# EAGLE design Keg Cop - Eight Straight (EAGLE 9.5.2)
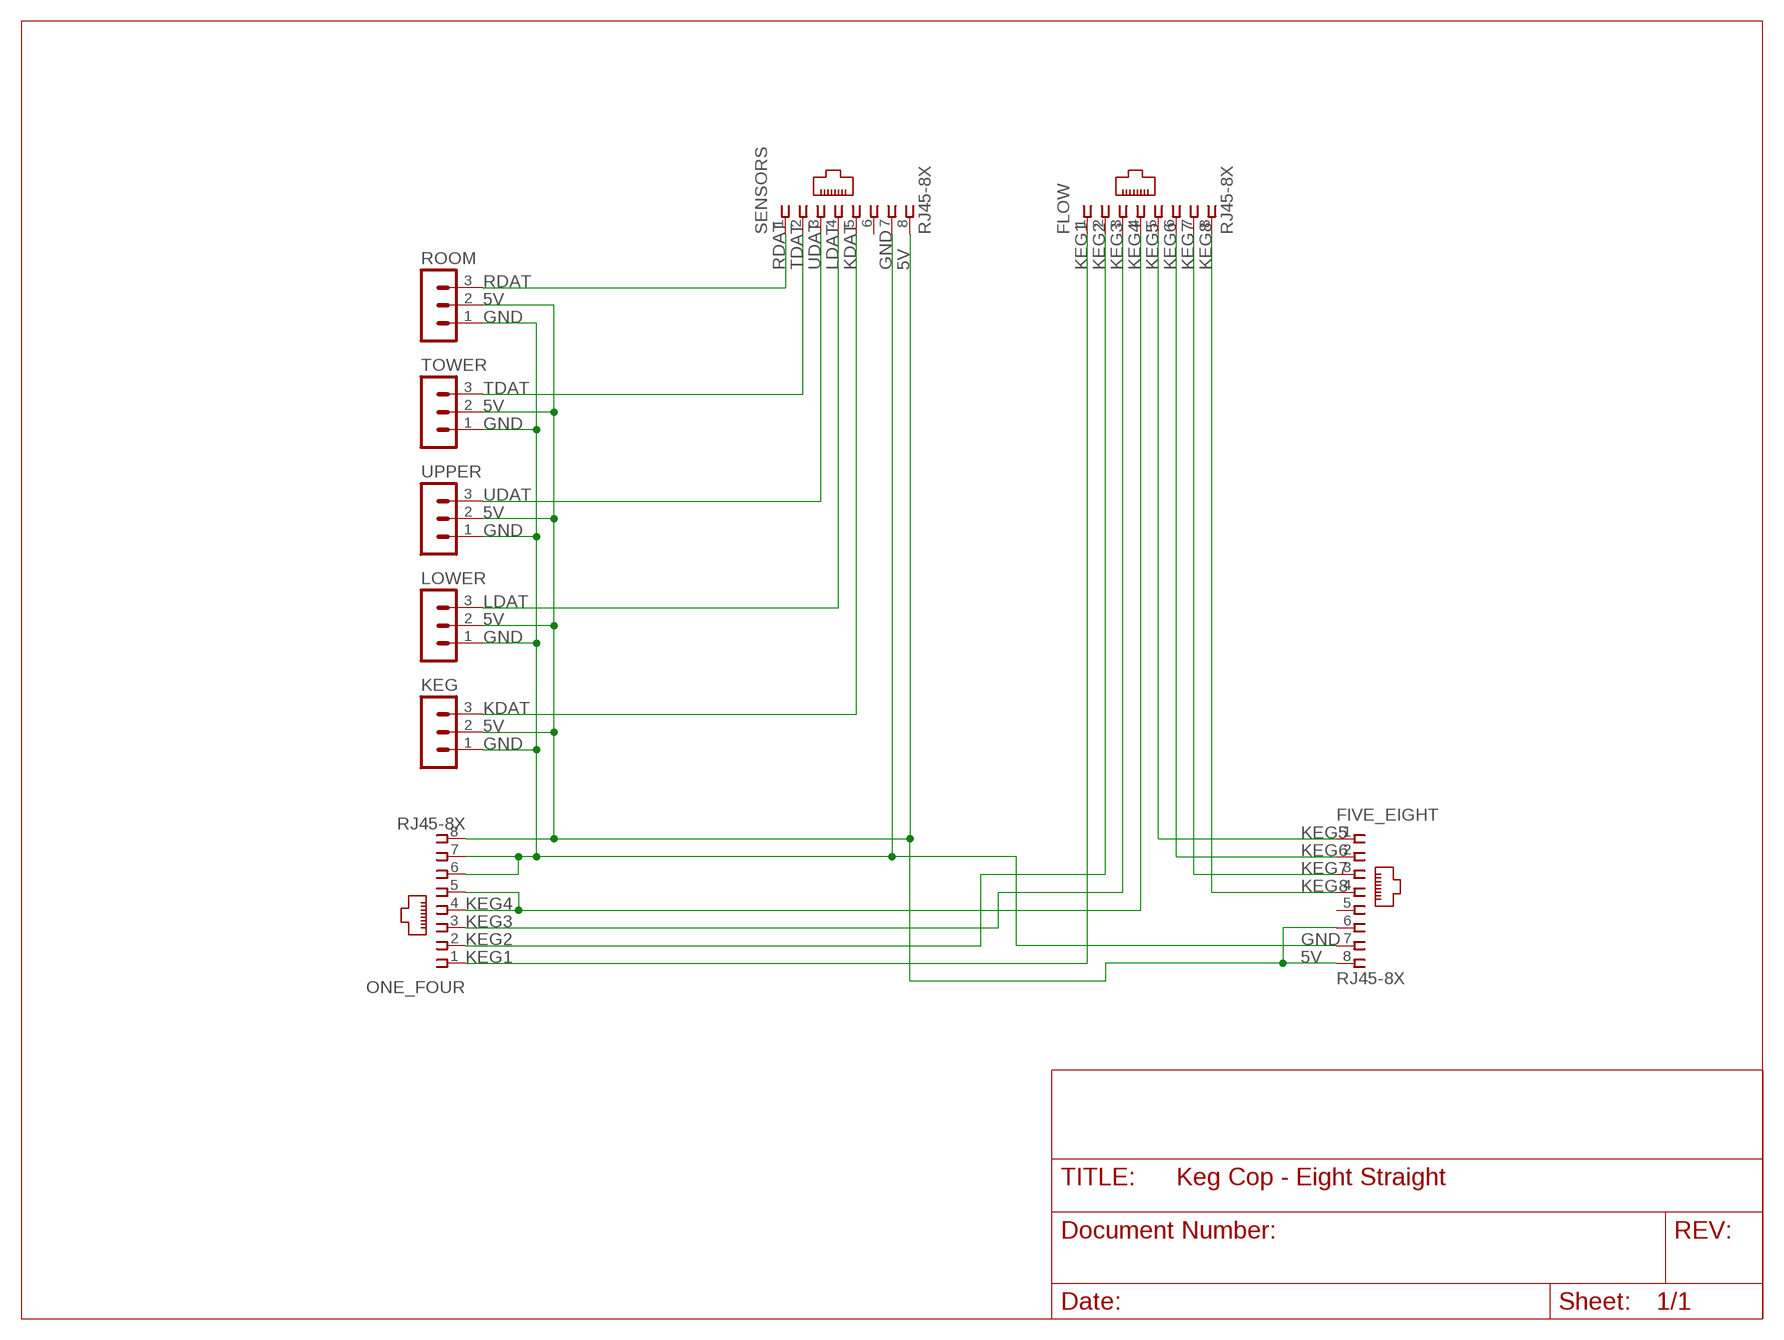
[diagram p0: schematic, sheet 1]

## Parts
FIVE_EIGHT  RJ45-8X  [RJ45-NO-SHIELD]
FLOW  RJ45-8X  [RJ45-NO-SHIELD]
KEG  HDR-3  [HDR-3_VERT]
LOWER  HDR-3  [HDR-3_VERT]
ONE_FOUR  RJ45-8X  [RJ45-NO-SHIELD]
ROOM  HDR-3  [HDR-3_VERT]
SENSORS  RJ45-8X  [RJ45-NO-SHIELD]
TOWER  HDR-3  [HDR-3_VERT]
UPPER  HDR-3  [HDR-3_VERT]

## Nets
5V: FIVE_EIGHT.6 FIVE_EIGHT.8 KEG.2 LOWER.2 ONE_FOUR.8 ROOM.2 SENSORS.8 TOWER.2 UPPER.2
GND: FIVE_EIGHT.7 KEG.1 LOWER.1 ONE_FOUR.6 ONE_FOUR.7 ROOM.1 SENSORS.7 TOWER.1 UPPER.1
KDAT: KEG.3 SENSORS.5
KEG1: FLOW.1 ONE_FOUR.1
KEG2: FLOW.2 ONE_FOUR.2
KEG3: FLOW.3 ONE_FOUR.3
KEG4: FLOW.4 ONE_FOUR.4 ONE_FOUR.5
KEG5: FIVE_EIGHT.1 FLOW.5
KEG6: FIVE_EIGHT.2 FLOW.6
KEG7: FIVE_EIGHT.3 FLOW.7
KEG8: FIVE_EIGHT.4 FLOW.8
LDAT: LOWER.3 SENSORS.4
RDAT: ROOM.3 SENSORS.1
TDAT: SENSORS.2 TOWER.3
UDAT: SENSORS.3 UPPER.3
Unconnected: FIVE_EIGHT.5 SENSORS.6

## Library data of the parts
FIVE_EIGHT FLOW ONE_FOUR SENSORS = con-tycoelectronics:RJ45: CORCOM Modular RJ Jacks No Shield Source: www.tycoelectronics.com .. ENG_DS_1654001_1099_RJ_L_0507.pdf; MPN: RJ45-8X; OC_FARNELL: unknown; OC_NEWARK: 16R6101
KEG LOWER ROOM TOWER UPPER = Donnie:HDR-3: PIN HEADER

## Board
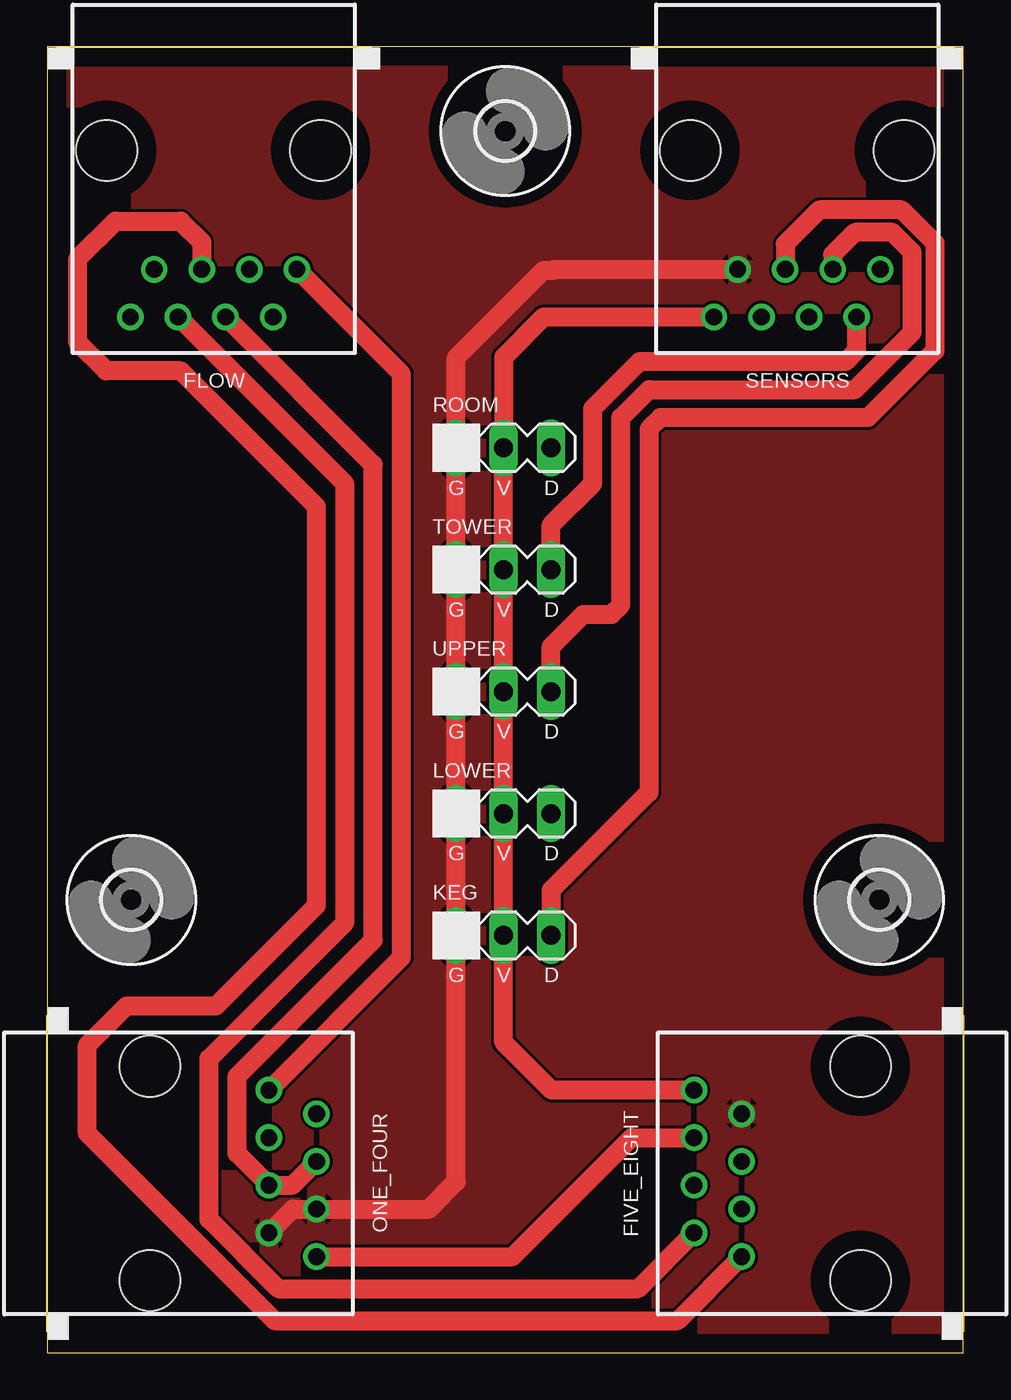
[diagram p1: board, top side]
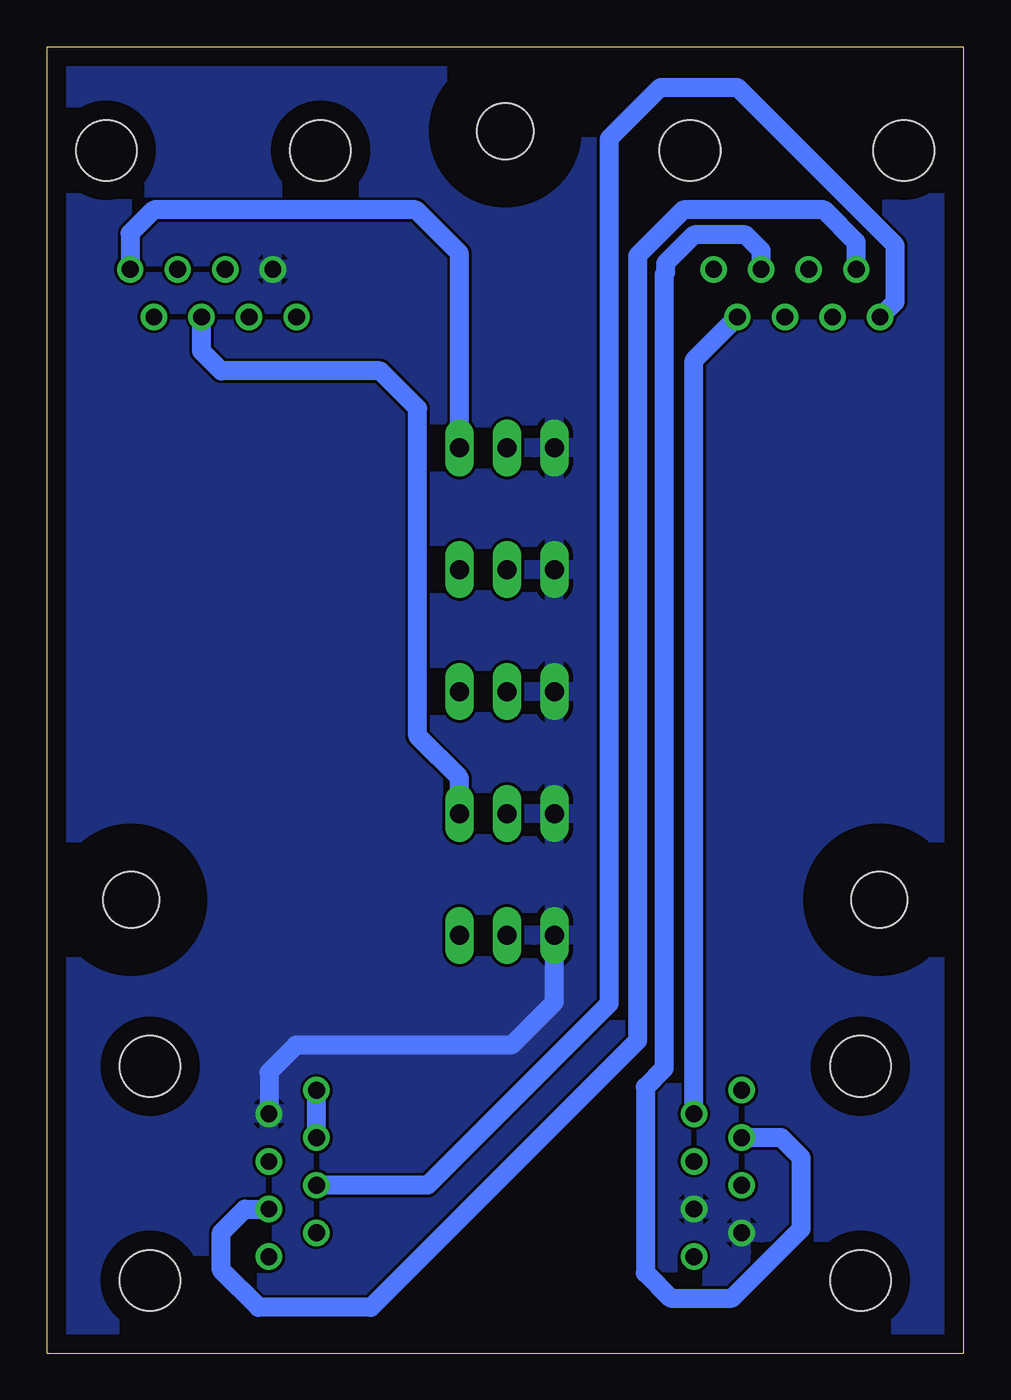
[diagram p2: board, bottom side, seen from below]

Size 48.97 x 69.74 mm. Coordinates in mm from the lower left corner, seen from the top.
Outline: 0.01,69.74 0.01,0 48.96,0 48.96,69.74 0.01,69.74
Copper layers (1*16): Top 0.035mm / dielectric 1.5mm / Bottom 0.035mm
Design rules "default": minimum track width 6mil, minimum drill 0.35mm, track to track 6mil, track to pad 6mil, pad to pad 6mil, via to via 6mil, smd to smd 6mil, copper to edge 40mil, drill to drill 6mil, minimum pad ring 10mil, minimum via ring 8mil, stop-mask expansion 4mil, vias tented up to drill 0mil, thermal gap 10mil

### Footprints (pad centres in the part's own frame; a part is rotated, then mirrored left to right if it is on the bottom)
RJ45-NO-SHIELD = drill 0.9 pad 1.4: 1 -4.445,6.35; 2 -3.175,8.89; 3 -1.905,6.35; 4 -0.635,8.89; 5 0.635,6.35; 6 1.905,8.89; 7 3.175,6.35; 8 4.445,8.89 | hole 3.251: -5.715,0; 5.715,0
HDR-3_VERT = drill 1.016 long: 1 0,0; 2 2.54,0; 3 5.08,0
3,0 = hole 3: 0,0

### Placement (x,y rotation side)
FIVE_EIGHT  43.46,9.6 90 top
FLOW  8.91,64.21 180 top
KEG  21.86,22.3 0 top
LOWER  21.86,28.81 0 top
ONE_FOUR  5.51,9.6 270 top
ROOM  21.86,48.34 0 top
SENSORS  40.08,64.21 180 top
TOWER  21.86,41.83 0 top
U$1  [3,0]  4.51,24.2 0 top
U$2  [3,0]  44.46,24.2 0 top
U$3  [3,0]  24.49,65.24 0 top
UPPER  21.86,35.32 0 top

### Tracks (layer width: path | path; a pad name or v marks a point on that pad's centre or on a via)
5V
  Top 1.016: SENSORS.8 26.54,55.32 24.4,53.18 24.4,48.44 | ONE_FOUR.8 24.88,5.16 31.23,11.51 FIVE_EIGHT.6 | FIVE_EIGHT.8 26.97,14.04 24.4,16.61 KEG.2 LOWER.2 UPPER.2 24.4,41.94 | 24.4,48.44 ROOM.2 | TOWER.2 24.4,41.94 | 24.4,41.94 24.4,48.44
  Bottom 1.016: FIVE_EIGHT.6 FIVE_EIGHT.8
GND
  Top 1.016: ONE_FOUR.7 13.13,7.7 ONE_FOUR.6 20.42,7.7 21.87,9.15 KEG.1 LOWER.1 UPPER.1 TOWER.1 ROOM.1 21.86,53.14 26.53,57.81 27.03,57.81 27.08,57.86 SENSORS.7
  Bottom 1.016: FIVE_EIGHT.7 37.11,14.99 35.66,16.44 24.16,16.44 21.86,18.74 KEG.1
  pour Top: -0.49,-0.3 -0.49,70.2 49.51,70.2 49.51,-0.3
  pour Bottom: 49.51,70.5 -0.49,70.5 -0.49,-0.5 49.51,-0.5
KDAT
  Top 1.016: KEG.3 26.94,24.72 32.16,29.94 32.16,49.34 32.76,49.94 43.86,49.94 47.43,53.51 47.43,59.27 45.66,61.04 41.26,61.04 39.44,59.22 SENSORS.5
KEG1
  Top 1.016: ONE_FOUR.1 18.94,21.12 18.94,52.27 FLOW.1
KEG2
  Bottom 1.016: ONE_FOUR.2 14.4,53.01 FLOW.2
KEG3
  Bottom 1.016: ONE_FOUR.3 9.75,11.51 8.67,10.43 8.67,6.64 12.37,2.94 15.66,2.94 17.01,4.29 17.01,14.2 16.01,15.2 16.01,57.59 15.92,57.68 15.92,58.18 14.4,59.7 11.66,59.7 10.82,58.86 FLOW.3
KEG4
  Top 1.016: ONE_FOUR.4 13.13,8.96 ONE_FOUR.5 10.16,10.66 10.16,14.78 17.43,22.05 17.43,47.44 FLOW.4
KEG5
  Top 1.016: FIVE_EIGHT.1 33.7,1.74 12.16,1.74 2.16,11.74 2.16,16.44 4.26,18.54 9.04,18.54 14.4,23.9 14.4,45.2 7.16,52.44 3.16,52.44 1.66,53.94 1.66,58.44 3.66,60.44 7.16,60.44 8.28,59.33 FLOW.5
KEG6
  Top 1.016: FIVE_EIGHT.2 31.59,3.44 12.36,3.44 8.66,7.14 8.66,15.72 15.92,22.98 15.92,46.41 FLOW.6
KEG7
  Bottom 1.016: FIVE_EIGHT.3 38.41,7.7 39.66,6.44 39.66,4.44 37.66,2.44 31.66,2.44 17.42,16.68 17.42,58.58 14.97,61.03 7.45,61.03 5.74,59.31 FLOW.7
KEG8
  Bottom 1.016: FIVE_EIGHT.4 28.64,8.96 18.94,18.66 18.94,64.83 16.19,67.58 12.1,67.58 3.66,59.14 3.66,56.12 FLOW.8
LDAT
  Bottom 1.016: LOWER.3 26.94,30.72 29.16,32.94 29.16,50.44 31.16,52.44 39.66,52.44 40.71,53.49 SENSORS.4
RDAT
  Bottom 1.016: ROOM.3 26.94,58.72 29.26,61.04 43.26,61.04 44.52,59.78 SENSORS.1
TDAT
  Top 1.016: SENSORS.2 43.25,53.53 42.66,52.94 31.66,52.94 29.16,50.44 29.16,46.44 26.94,44.22 TOWER.3
UDAT
  Top 1.016: UPPER.3 26.94,37.72 28.66,39.44 30.16,39.44 30.66,39.94 30.66,49.94 32.16,51.44 43.16,51.44 46.22,54.5 46.22,58.78 45.16,59.84 43.16,59.84 41.98,58.66 SENSORS.3

### Text on the board
tNames: G | V | D | G | V | D | G | V | D | G | V | D | G | V | D